# EasyEDA Pro project ProPrj_星闪核心板_2024-08-30.epro

# Schematic 星闪
Board Name: 星闪; Create Date: 2024-08-24; Page Name: Sheet_1; Project Name: 星闪核心板; Schematic Name: 星闪; Update Date: 2024-08-27; Company: Hny0305Lin & LiRong; Draw By: LiRong; REV: 1.0.1
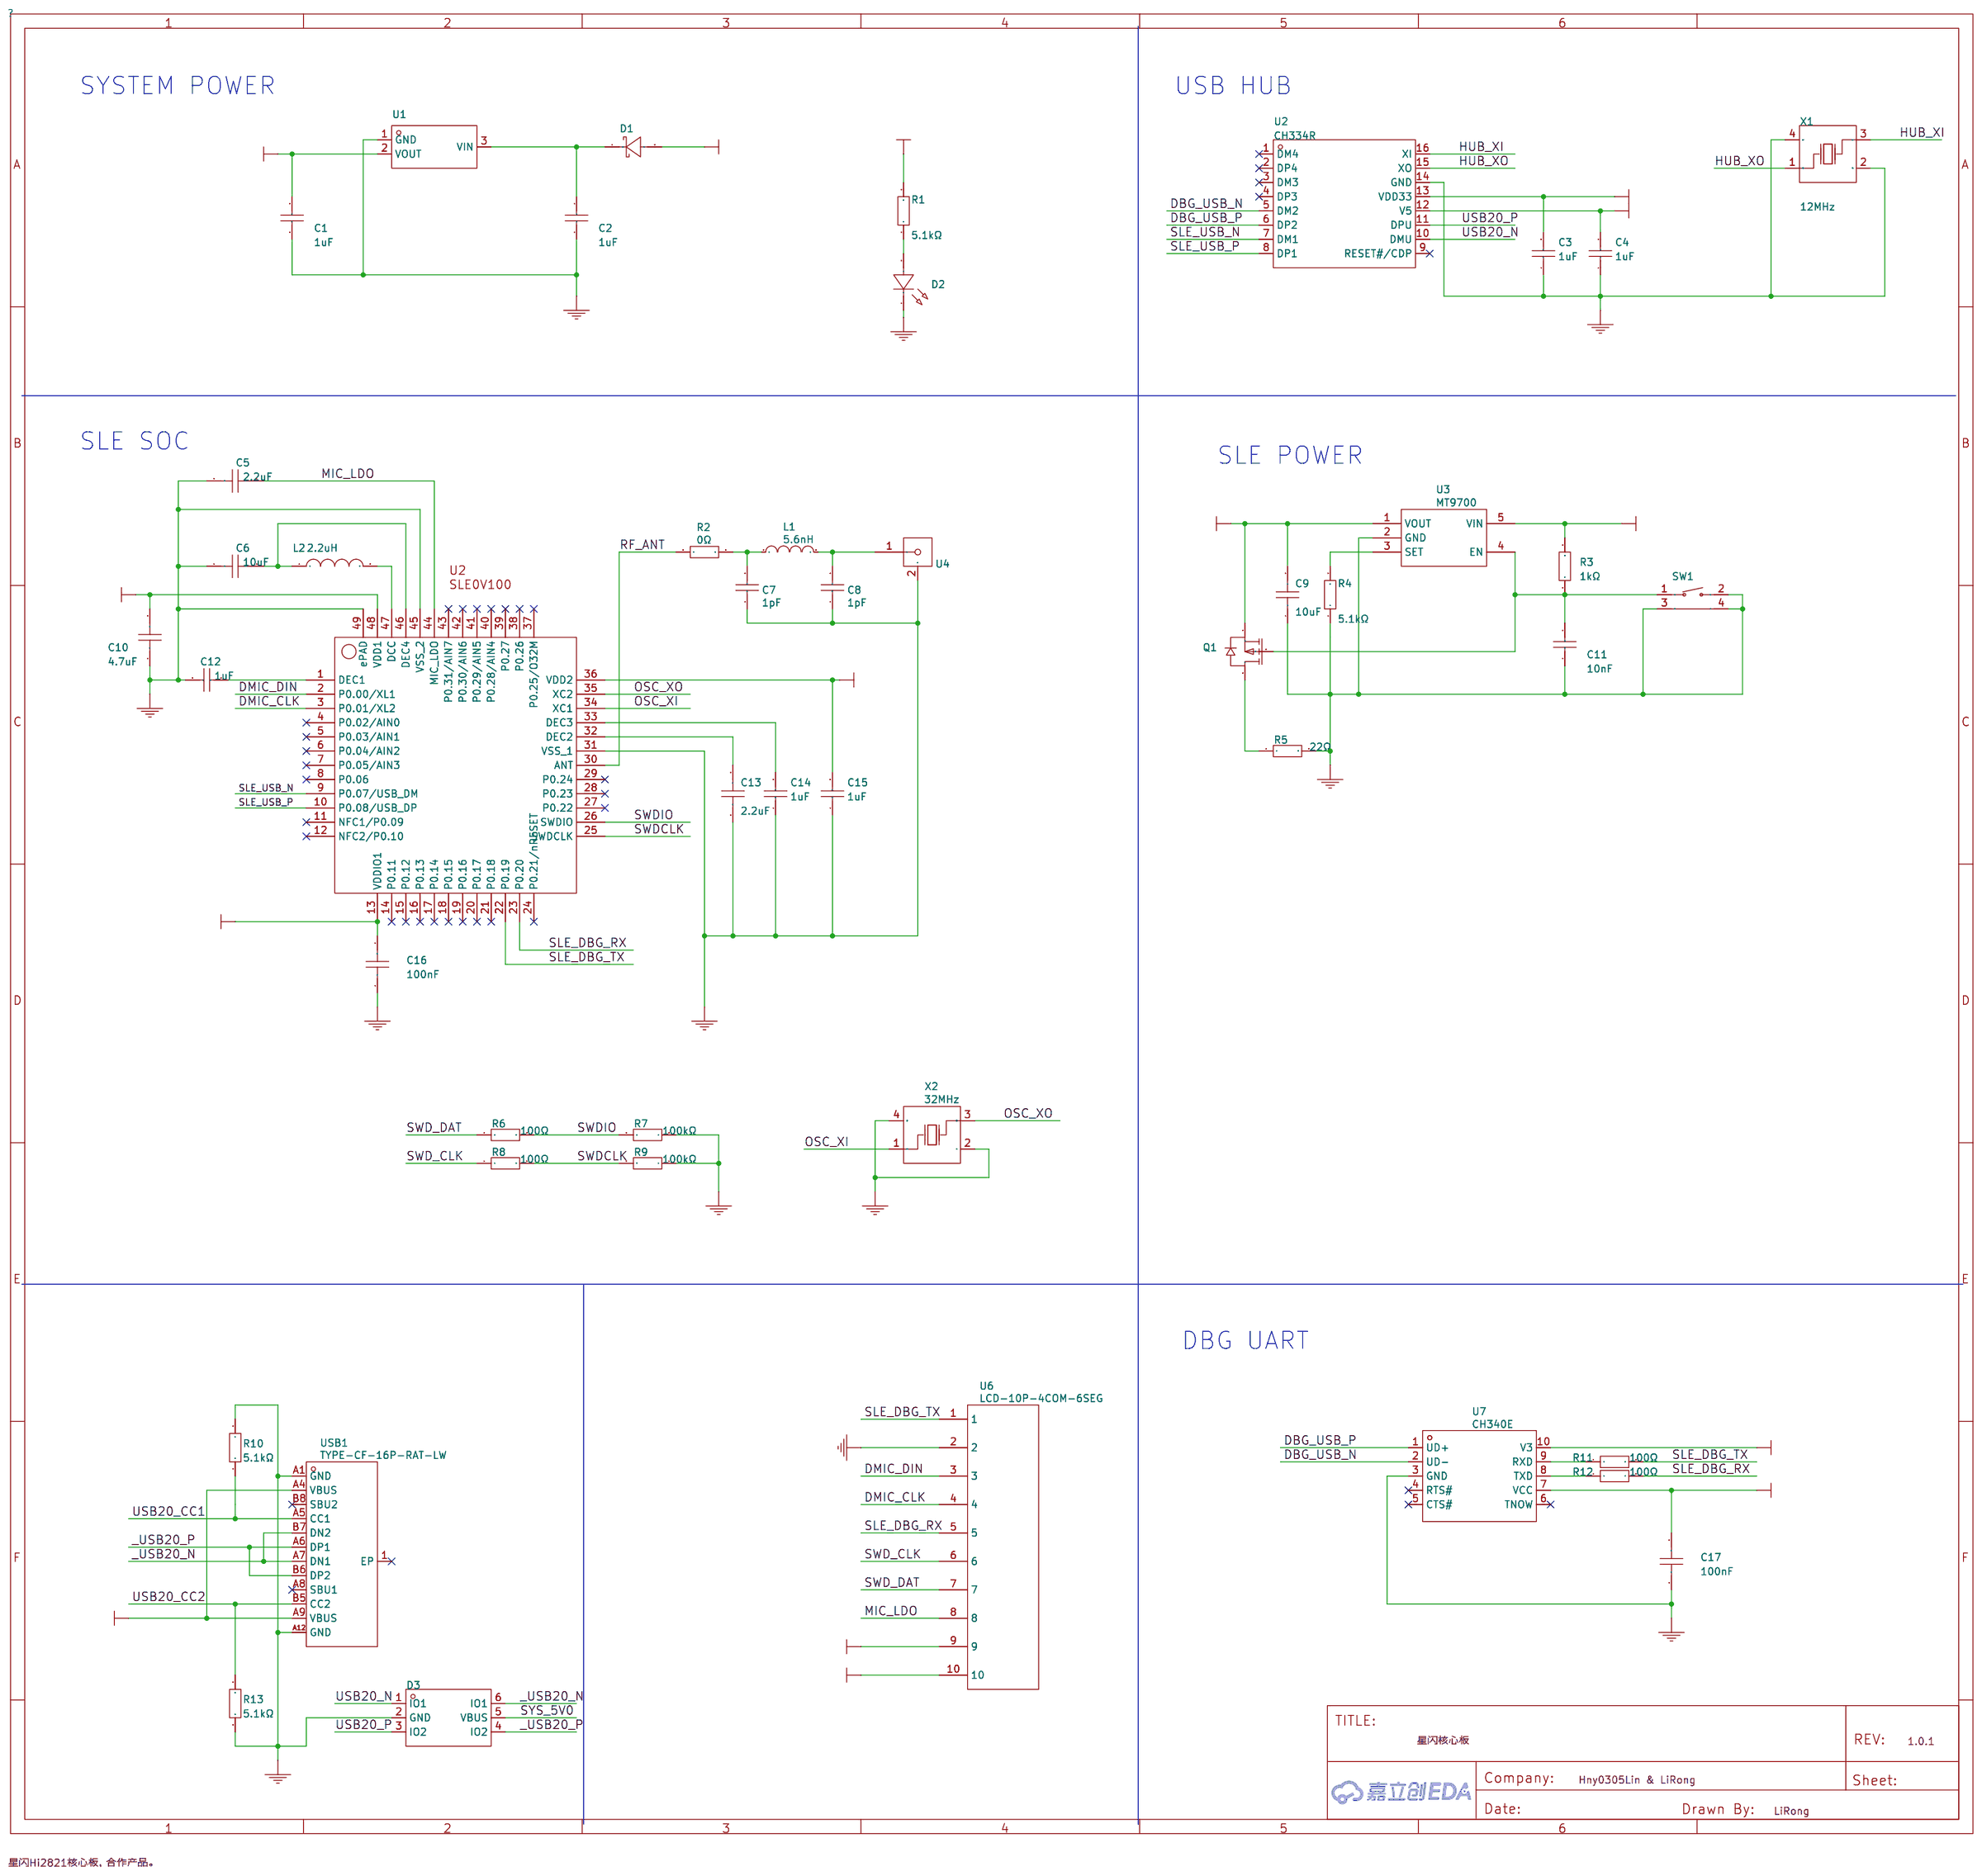
[diagram p0: schematic sheet]

## Parts
C1  1uF  [C0603]
C2  1uF  [C0603]
C3  1uF  [C0402]
C4  1uF  [C0402]
C5  2.2uF  [C0402]
C6  10uF  [C0603]
C7  1pF  [C0201]
C8  1pF  [C0201]
C9  10uF  [C0603]
C10  4.7uF  [C0402]
C11  10nF  [C0402]
C12  1uF  [C0402]
C13  2.2uF  [C0402]
C14  1uF  [C0402]
C15  1uF  [C0402]
C16  100nF  [C0402]
C17  100nF  [C0402]
D1  B5817WS  [SOD-323_L1.7-W1.3-LS2.5-RD]
D2  XL-1608SURC-06  [LED0603-RD_RED]
D3  USBLC6-2SC6  [SOT-23-6_L2.9-W1.6-P0.95-LS2.8-BL]
L1  5.6nH  [L0201]
L2  2.2uH  [0805]
Q1  RU20P7C-A  [SOT-23-3_L3.0-W1.6-P1.90-LS2.8-BR]
R1  5.1kΩ  [R0402]
R2  0Ω  [R0201]
R3  1kΩ  [R0402]
R4  5.1kΩ  [R0402]
R5  22Ω  [R0402]
R6  100Ω  [R0402]
R7  100kΩ  [R0402]
R8  100Ω  [R0402]
R9  100kΩ  [R0402]
R10  5.1kΩ  [R0402]
R11  100Ω  [R0402]
R12  100Ω  [R0402]
R13  5.1kΩ  [R0402]
SW1  TS-1135-C  [SW-SMD_YIYUAN_YTS-B017-2H]
U1  XC6206-3.3NR  [SOT-23-3_L2.9-W1.3-P0.95-LS2.4-BR]
U2  CH334R  [QSOP-16_L4.9-W3.9-P0.64-LS6.0-BL]
U3  MT9700  [SOT-23-5_L3.0-W1.7-P0.95-LS2.8-BR]
U4  U.FL-R-SMT-1(80)_C9900020048  [IPEX-SMD_4P-L2.6-W2.6-LS3.0-1]
U5  SLE0V100(1)  [QFN_48XINGSHAN]
U6  LCD-10P-4COM-6SEG  [DU10_3.5]
U7  CH340E  [MSOP-10_L3.0-W3.0-P0.50-LS5.0-BL]
USB1  TYPE-CF-16P-RAT-LW  [TYPE-C-SMD_TYPE-CF-16P-RAT-LW]
X1  12MHz  [OSC-SMD_4P-L3.2-W2.5-BL]
X2  32MHz  [CRYSTAL-SMD_4P-L3.2-W2.5-BL]

## Library data of the parts
C1 C2 = CL10A105KO8NNNC: 容值:1uF;精度:±10%;额定电压:16V;材质(温度系数):X5R;; LCSC Part Name: 1uF ±10% 16V; Supplier Part: C1592; Manufacturer: SAMSUNG(三星); Supplier Footprint: 0603; Datasheet: https://atta.szlcsc.com/upload/public/pdf/source/20220919/9FBE606BE0D9532D730F292EB26DC5BB.pdf; Supplier: LCSC; Tolerance: ±10%; Voltage Rated: 16V; Temperature Coefficient: X5R
C3 C4 C12 C14 C15 = CL05A105KP5NNNC: 容值:1uF;精度:±10%;额定电压:10V;材质(温度系数):X5R;; LCSC Part Name: 1uF ±10% 10V; Supplier Part: C14445; Manufacturer: SAMSUNG(三星); Supplier Footprint: 0402; JLCPCB Part Class: 扩展库; Datasheet: https://atta.szlcsc.com/upload/public/pdf/source/20160218/1457707763339.pdf; Supplier: LCSC; Tolerance: ±10%; Voltage Rated: 10V; Temperature Coefficient: X5R
C5 C13 = CL05A225KP5NSNC: 容值:2.2uF;精度:±10%;额定电压:10V;材质(温度系数):X5R;; LCSC Part Name: 2.2uF ±10% 10V; Supplier Part: C107369; Manufacturer: SAMSUNG(三星); Supplier Footprint: 0402; JLCPCB Part Class: 扩展库; Datasheet: https://atta.szlcsc.com/upload/public/pdf/source/20160218/1457707763339.pdf; Supplier: LCSC; Tolerance: ±10%; Voltage Rated: 10V; Temperature Coefficient: X5R
C6 C9 = CL10A106MP8NNNC: 容值:10uF;精度:±20%;额定电压:10V;材质(温度系数):X5R;; LCSC Part Name: 10uF ±20% 10V; Supplier Part: C85713; Manufacturer: SAMSUNG(三星); Supplier Footprint: 0603; JLCPCB Part Class: 扩展库; Datasheet: https://atta.szlcsc.com/upload/public/pdf/source/20160218/1457707763339.pdf; Supplier: LCSC; Tolerance: ±20%; Voltage Rated: 10V; Temperature Coefficient: X5R
C7 C8 = 1pF: Supplier: LCSC; Manufacturer: muRata(村田); Manufacturer Part: GRM0335C1E1R0BA01D; Supplier Part: C88903; JLCPCB Part Class: Extended Part
C10 = CL05A475MQ5NRNC: 容值:4.7uF;精度:±20%;额定电压:6.3V;材质(温度系数):X5R;; LCSC Part Name: 4.7uF ±20% 6.3V; Supplier Part: C307423; Manufacturer: SAMSUNG(三星); Supplier Footprint: 0402; JLCPCB Part Class: 扩展库; Datasheet: https://atta.szlcsc.com/upload/public/pdf/source/20181010/C307423_0E0C4E35F3A09F81C2E5C84E00499E42.pdf; Supplier: LCSC; Tolerance: ±20%; Voltage Rated: 6.3V; Temperature Coefficient: X5R
C11 = CC0402KRX7R9BB103: 容值:10nF;精度:±10%;额定电压:50V;材质(温度系数):X7R;; LCSC Part Name: 10nF ±10% 50V; Supplier Part: C60133; Manufacturer: YAGEO(国巨); Supplier Footprint: 0402; JLCPCB Part Class: 扩展库; Datasheet: https://atta.szlcsc.com/upload/public/pdf/source/20180224/C181747_15194369449651363981.pdf; Supplier: LCSC; Tolerance: ±10%; Voltage Rated: 50V; Temperature Coefficient: X7R
C16 C17 = CL05B104KO5NNNC: 容值:100nF;精度:±10%;额定电压:16V;材质(温度系数):X7R;; LCSC Part Name: 100nF ±10% 16V; Supplier Part: C1525; Manufacturer: SAMSUNG(三星); Supplier Footprint: 0402; JLCPCB Part Class: 基础库; Datasheet: https://atta.szlcsc.com/upload/public/pdf/source/20160218/1457707763339.pdf; Supplier: LCSC; Tolerance: ±10%; Voltage Rated: 16V; Temperature Coefficient: X7R
D1 = B5817WS_C5178966: 二极管配置:独立式;正向压降(Vf):450mV@1A;直流反向耐压(Vr):20V;平均整流电流(Io):1A;; Supplier Part: C5178966; Manufacturer: FUXINSEMI(富芯森美); Supplier Footprint: SOD-323; JLCPCB Part Class: 扩展库; Datasheet: https://atta.szlcsc.com/upload/public/pdf/source/20220920/7F1C3B1AD8E64D51E240979EF5B99150.pdf; Supplier: LCSC; Diode Configuration: 独立式; Forward Voltage (Vf@If): 450mV@1A; Reverse Voltage (Vr): 20V; Average Rectified Current (Io): 1A; Reverse Leakage Current (Ir): 1mA@20V; Peak forward surge current: 9A
D2 = XL-1608SURC-06: 发光颜色:红色;功率:55mW;正向电流:25mA;主波长:617nm~621nm;透镜颜色:无色透明透镜;色温:-;发光角度:120°;载带方式:正贴;工作温度:-30℃~+85℃;; Supplier Part: C965799; Manufacturer: XINGLIGHT(成兴光); Supplier Footprint: 0603; JLCPCB Part Class: Extended Part; Datasheet: https://atta.szlcsc.com/upload/public/pdf/source/20221102/D860AFDD1CDB02C5A8064103A32707E2.pdf; Supplier: LCSC; Emitted Color: 红色; Power Dissipation: 55mW; Forward Current: 25mA; Dominant Wavelength: 617nm~621nm; Peak Wavelength: 623nm; Lens Color: 无色透明透镜; Viewing Angle: 120°; Mounting Sytle: 正贴; Operating Temperature: -30℃~+85℃
D3 = USBLC6-2SC6_C2827654: 极性:-;反向截止电压(Vrwm):-;最大钳位电压:-;峰值脉冲电流(Ipp)@10/1000us:-;峰值脉冲功率(Ppp)@10/1000us:-;击穿电压:-;; LCSC Part Name: ESD，可防30kV静电; Supplier Part: C2827654; Manufacturer: TECH PUBLIC(台舟); Supplier Footprint: SOT-23-6; JLCPCB Part Class: 扩展库; Datasheet: https://atta.szlcsc.com/upload/public/pdf/source/20210810/FBD75DE717D6D97BAC6DD7F2B5C09DCD.pdf; Supplier: LCSC; Type: ESD
L1 = 5.6nH: Supplier: LCSC; Manufacturer: muRata(村田); Manufacturer Part: LQP03TN5N6H02D; Supplier Part: C86127; JLCPCB Part Class: Extended Part
L2 = MGFL2012F2R2MT-LF: 电感值:2.2uH;精度:±20%;额定电流:1.2A;饱和电流(Isat):-;直流电阻(DCR):200mΩ;; LCSC Part Name: 2.2uH ±20%; Supplier Part: C281115; Manufacturer: microgate(麦捷科技); JLCPCB Part Class: Extended Part; Datasheet: https://atta.szlcsc.com/upload/public/pdf/source/20181025/C281115_505B7E12862DFB0F0E16D6C8DCCBFFF1.pdf; Supplier: LCSC; Tolerance: ±20%; Rated Current: 1.2A; DC Resistance (DCR): 200mΩ
Q1 = RU20P7C-A: Supplier: LCSC; Supplier Part: C2977192; Manufacturer: Ruichips(锐骏半导体)
R1 R4 R10 R13 = 0402WGF5101TCE: 电阻类型:厚膜电阻;阻值:5.1kΩ;精度:±1%;功率:62.5mW;最大工作电压:50V;温度系数:±100ppm/℃;; LCSC Part Name: 5.1kΩ ±1% 62.5mW 厚膜电阻; Supplier Part: C25905; Manufacturer: UNI-ROYAL(厚声); Supplier Footprint: 0402; JLCPCB Part Class: 基础库; Datasheet: https://atta.szlcsc.com/upload/public/pdf/source/20200306/C422600_1E6D84923E4A46A82E41ADD87F860B5C.pdf; Supplier: LCSC; Type: 厚膜电阻; Tolerance: ±1%; Power(Watts): 62.5mW; Overload Voltage (Max): 50V; Temperature Coefficient: ±100ppm/℃; Operating Temperature Range: -55℃~+155℃
R2 = 0Ω: Supplier: LCSC; Supplier Part: C270337; Manufacturer: UNI-ROYAL(厚声); Manufacturer Part: 0201WMJ0000TEE; JLCPCB Part Class: Extended Part
R3 = 0402WGF1001TCE: 电阻类型:厚膜电阻;阻值:1kΩ;精度:±1%;功率:62.5mW;最大工作电压:50V;温度系数:±100ppm/℃;; LCSC Part Name: 1kΩ ±1% 62.5mW 厚膜电阻; Supplier Part: C11702; Manufacturer: UNI-ROYAL(厚声); Supplier Footprint: 0402; JLCPCB Part Class: 基础库; Datasheet: https://atta.szlcsc.com/upload/public/pdf/source/20200306/C422600_1E6D84923E4A46A82E41ADD87F860B5C.pdf; Supplier: LCSC; Type: 厚膜电阻; Tolerance: ±1%; Power(Watts): 62.5mW; Overload Voltage (Max): 50V; Temperature Coefficient: ±100ppm/℃; Operating Temperature Range: -55℃~+155℃
R5 = 0402WGF220JTCE: 电阻类型:厚膜电阻;阻值:22Ω;精度:±1%;功率:62.5mW;最大工作电压:50V;温度系数:±100ppm/℃;; LCSC Part Name: 22Ω ±1% 62.5mW 厚膜电阻; Supplier Part: C25092; Manufacturer: UNI-ROYAL(厚声); Supplier Footprint: 0402; JLCPCB Part Class: 基础库; Datasheet: https://atta.szlcsc.com/upload/public/pdf/source/20200306/C422600_1E6D84923E4A46A82E41ADD87F860B5C.pdf; Supplier: LCSC; Type: 厚膜电阻; Tolerance: ±1%; Power(Watts): 62.5mW; Overload Voltage (Max): 50V; Temperature Coefficient: ±100ppm/℃; Operating Temperature Range: -55℃~+155℃
R6 R8 R11 R12 = 0402WGF1000TCE: 电阻类型:厚膜电阻;阻值:100Ω;精度:±1%;功率:62.5mW;最大工作电压:50V;温度系数:±200ppm/℃;; LCSC Part Name: 100Ω ±1% 62.5mW 厚膜电阻; Supplier Part: C25076; Manufacturer: UNI-ROYAL(厚声); Supplier Footprint: 0402; JLCPCB Part Class: 基础库; Datasheet: https://atta.szlcsc.com/upload/public/pdf/source/20200306/C422600_1E6D84923E4A46A82E41ADD87F860B5C.pdf; Supplier: LCSC; Type: 厚膜电阻; Tolerance: ±1%; Power(Watts): 62.5mW; Overload Voltage (Max): 50V; Temperature Coefficient: ±200ppm/℃; Operating Temperature Range: -55℃~+155℃
R7 R9 = RC0402FR-07100KL: 电阻类型:厚膜电阻;阻值:100kΩ;精度:±1%;功率:62.5mW;最大工作电压:50V;温度系数:±100ppm/℃;; LCSC Part Name: 厚膜电阻 100kΩ ±1% 62.5mW; Supplier Part: C60491; Manufacturer: YAGEO(国巨); Supplier Footprint: 0402; JLCPCB Part Class: 扩展库; Datasheet: https://atta.szlcsc.com/upload/public/pdf/source/20180927/C295883_E8D83085EA81BD7DE0B2B681138C15EE.pdf; Supplier: LCSC; Type: 厚膜电阻; Tolerance: ±1%; Power(Watts): 62.5mW; Overload Voltage (Max): 50V; Temperature Coefficient: ±100ppm/℃; Operating Temperature Range: -55℃~+155℃
SW1 = TS-1135-C: 电路结构:单刀单掷;按钮形状:矩形按钮;作用力:260gf;安装方式:-;开关长度:6.15mm;开关宽度:3.55mm;开关高度:2.45mm;带支架:不带;触点电流:50mA;额定电压(AC):-;额定电压(DC):12V;额定功率:-;绝缘电阻:-;带灯:无;机械寿命:10万次;; LCSC Part Name: 3*6包盖 沉板式侧按键开关TS-1135-C; Supplier Part: C519275; Manufacturer: XKB Connectivity(中国星坤); Supplier Footprint: SMD; Datasheet: https://atta.szlcsc.com/upload/public/pdf/source/20200423/C519275_2FF3ECA9711A0F372711CEA0AA6AFE29.pdf; Supplier: LCSC; Circuit: 单刀单掷; Actuator Style: 矩形按钮; Operating Force: 260gf; Switch Length: 6.15mm; Switch Width: 3.55mm; Switch Height: 2.45mm; Strike Gundam: 不带; Contact Current: 50mA; Voltage Rating (DC): 12V; Actuator/Cap Color: 白色; With Lamp: 无; Mechanical Life: 10万次; Operating Temperature: -40℃~+90℃
U1 = XC6206-3.3NR: LCSC Part Name: XC6206-3.3NR小体积; Supplier Part: C2984874; Manufacturer: HX(恒佳兴); Supplier Footprint: SOT-23; JLCPCB Part Class: 扩展库; Datasheet: https://atta.szlcsc.com/upload/public/pdf/source/20220328/86A37D0E6EE2F6DF94D50B2B86284E3B.pdf; Supplier: LCSC
U2 = CH334R: Supplier: LCSC; Supplier Part: C4154405; Manufacturer: WCH(南京沁恒); JLCPCB Part Class: Extended Part
U3 = MT9700: Supplier: LCSC; Manufacturer: 西安航天民芯; Supplier Part: C89855; JLCPCB Part Class: Extended Part
U4 = U.FL-R-SMT-1(80)_C9900020048: Supplier: LCSC; Supplier Part: C9900020048; Manufacturer: null; Manufacturer Part: U.FL-R-SMT-1(80); JLCPCB Part Class: Extended Part; Check: false
U5 = SLE0V100(1): Check: false
U6 = LCD-10P-4COM-6SEG: Supplier Part: 10p; Check: false
U7 = CH340E: Supplier: LCSC; Manufacturer: WCH(南京沁恒); Supplier Part: C99652; JLCPCB Part Class: Extended Part
USB1 = TYPE-CF-16P-RAT-LW: Supplier: LCSC; Supplier Part: C9900026770; Manufacturer: null; JLCPCB Part Class: Extended Part; Check: false
X1 = X322512MSB4SI: 晶振类型:贴片晶振;频率:12MHz;常温频差:±10ppm;外接负载电容:20pF;频率稳定度(全温):±20ppm;; LCSC Part Name: 12MHz ±10ppm 20pF; Supplier Part: C9002; Manufacturer: YXC(扬兴晶振); Supplier Footprint: SMD3225-4P; JLCPCB Part Class: 基础库; Datasheet: https://atta.szlcsc.com/upload/public/pdf/source/20240329/19D5F850207469550BEB00D7DFEDBC7A.pdf; Supplier: LCSC; Crystal Type: 贴片晶振; Normal temperature Frequency Tolerance: ±10ppm; External load capacitor: 20pF; Frequency Stability(Full temperature range): ±20ppm; Operating Temperature: -40℃~+85℃
X2 = S3232000081040: 晶振类型:贴片晶振;频率:32MHz;常温频差:±10ppm;外接负载电容:8pF;; LCSC Part Name: 32MHz ±10ppm 8pF; Supplier Part: C426985; Manufacturer: JGHC(晶光华); Supplier Footprint: SMD3225-4P; JLCPCB Part Class: Extended Part; Datasheet: https://atta.szlcsc.com/upload/public/pdf/source/20191012/C431172_99BCDFC5E39E114929AE7F9C9DED2B9F.pdf; Supplier: LCSC; Crystal Type: 贴片晶振; Normal temperature Frequency Tolerance: ±10ppm; External load capacitor: 8pF; Equivalent Series Resistance (ESR): 40Ω; Operating Temperature: -40℃~+85℃

## Nets
GND: C1.1 C2.1 C3.1 C4.1 C5.2 C6.1 C7.1 C8.1 C9.1 C10.1 C11.1 C12.1 C13.1 C14.1 C15.1 C16.1 C17.1 D2.1(K) D3.2(GND) R4.1 R5.2 R7.1 R9.1 R10.2 R13.1 SW1.2 SW1.3 SW1.4 U1.1(GND) U2.14(GND) U3.2(GND) U4.2 U5.31(VSS_1) U5.45(VSS_2) U5.49(ePAD) U6.2 U7.3(GND) USB1.A1(GND) USB1.A12(GND) X1.2(GND) X1.4(GND) X2.2(GND) X2.4(GND)
_USB20_N: D3.6(IO1) USB1.A7(DN1) USB1.B7(DN2)
_USB20_P: D3.4(IO2) USB1.A6(DP1) USB1.B6(DP2)
DBG_3V3: C3.2 C17.2 U2.13(VDD33) U7.7(VCC) U7.10(V3)
DBG_USB_N: U2.5(DM2) U7.2(UD-)
DBG_USB_P: U2.6(DP2) U7.1(UD+)
DMIC_CLK: U5.3(P0.01/XL2) U6.4
DMIC_DIN: U5.2(P0.00/XL1) U6.3
HUB_XI: U2.16(XI) X1.3(OSC2)
HUB_XO: U2.15(XO) X1.1(OSC1)
MIC_LDO: C5.1 U5.44(MIC_LDO) U6.8
OSC_XI: U5.34(XC1) X2.1(OSC1)
OSC_XO: U5.35(XC2) X2.3(OSC2)
RF_ANT: R2.1 U5.30(ANT)
SLE_3V3: C9.2 C10.2 C15.2 C16.2 Q1.2(S) U3.1(VOUT) U5.13(VDDIO1) U5.36(VDD2) U5.48(VDD1)
SLE_DBG_RX: R12.2 U5.23(P0.20) U6.5
SLE_DBG_TX: R11.2 U5.22(P0.19) U6.1
SLE_USB_N: U2.7(DM1) U5.9(P0.07/USB_DM)
SLE_USB_P: U2.8(DP1) U5.10(P0.08/USB_DP)
SWD_CLK: R8.1 U6.6
SWD_DAT: R6.1 U6.7
SWDCLK: R8.2 R9.2 U5.25(SWDCLK)
SWDIO: R6.2 R7.2 U5.26(SWDIO)
SYS_3V3: C1.2 R1.2 R3.2 U1.2(VOUT) U3.5(VIN) U6.9
SYS_5V0: C4.2 D1.2(A) D3.5(VBUS) U2.12(V5) U6.10 USB1.A4(VBUS) USB1.A9(VBUS)
USB20_CC1: R10.1 USB1.A5(CC1)
USB20_CC2: R13.2 USB1.B5(CC2)
USB20_N: D3.1(IO1) U2.10(DMU)
USB20_P: D3.3(IO2) U2.11(DPU)
$1N5: C8.2 L1.2 U4.1
$1N6: C7.2 L1.1 R2.2
$1N16: Q1.3(D) R5.1
$1N45: C2.2 D1.1(C) U1.3(VIN)
$1N49: L2.2 U5.47(DCC)
$1N98: D2.2(A) R1.1
$1N2110: C12.2 U5.1(DEC1)
$1N2624: C14.2 U5.33(DEC3)
$1N2741: C13.2 U5.32(DEC2)
$1N3792: C6.2 L2.1 U5.46(DEC4)
$1N4086: R11.1 U7.9(RXD)
$1N4091: R12.1 U7.8(TXD)
$1N5044: R4.2 U3.3(SET)
$1N8181: C11.2 Q1.1(G) R3.1 SW1.1 U3.4(EN)

Not connected (* = marked no-connect by the designer): U2 1(DM4)* 2(DP4)* 3(DM3)* 4(DP3)* 9(RESET#/CDP)*; U5 4(P0.02/AIN0)* 5(P0.03/AIN1)* 6(P0.04/AIN2)* 7(P0.05/AIN3)* 8(P0.06)* 11(NFC1/P0.09)* 12(NFC2/P0.10)* 14(P0.11)* 15(P0.12)* 16(P0.13)* 17(P0.14)* 18(P0.15)* 19(P0.16)* 20(P0.17)* 21(P0.18)* 24(P0.21/nRESET)* 27(P0.22)* 28(P0.23)* 29(P0.24)* 37(P0.25/O32M)* 38(P0.26)* 39(P0.27)* 40(P0.28/AIN4)* 41(P0.29/AIN5)* 42(P0.30/AIN6)* 43(P0.31/AIN7)*; U7 4(RTS#)* 5(CTS#)* 6(TNOW)*; USB1 1(EP)* A8(SBU1)* B8(SBU2)*

## Notes on the sheet
- SYSTEM POWER
- USB HUB
- SLE SOC
- SLE POWER
- DBG UART

# Board PCB_星闪
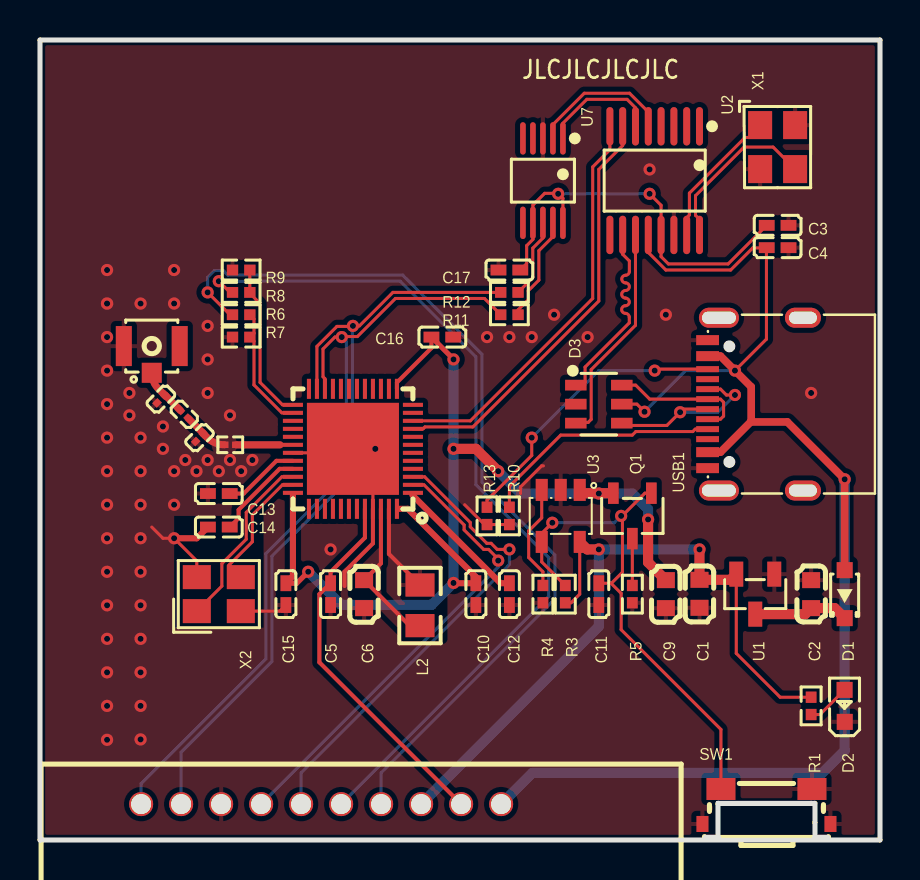
[diagram p1: board, top side]
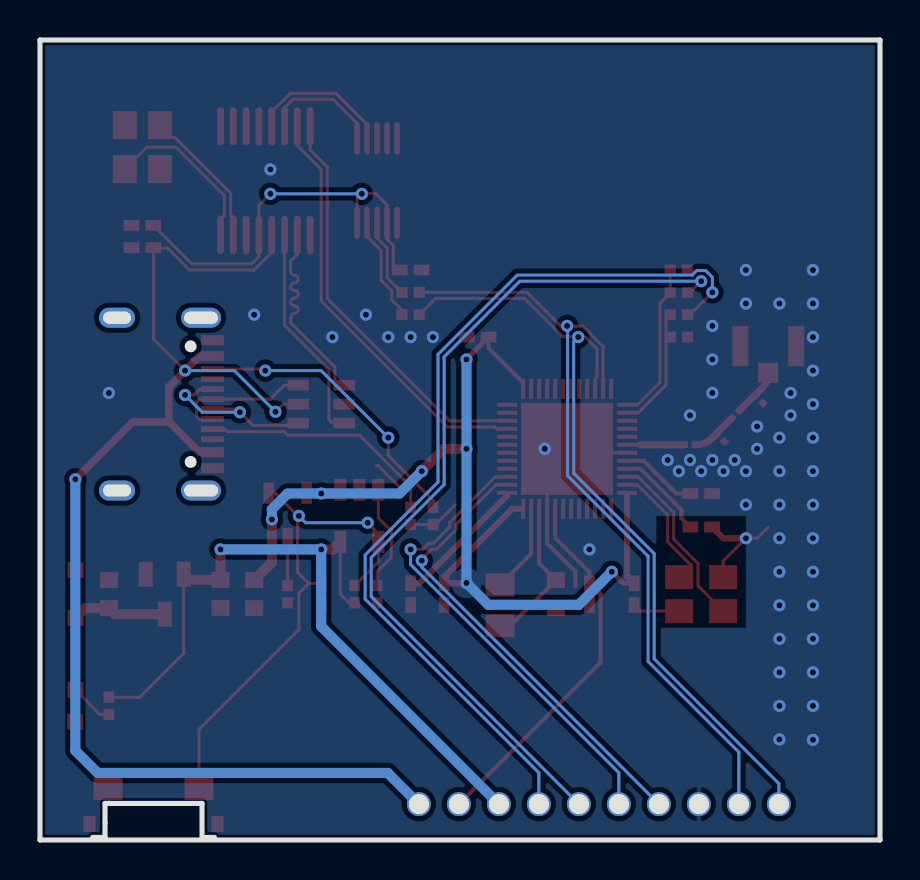
[diagram p2: board, bottom side, seen from below]

Outline 42 x 40 mm; copper layers: Top Layer, Bottom Layer. Coordinates in mm from the lower left corner of the outline.
Outline path: 0,40 42,40 42,0 0,0 0,40
Stack: Top Layer 0.035mm / Dielectric1 1.51mm FR4 er 4.5 / Bottom Layer 0.035mm

## Design rules (mm)
template: 用户自定义配置
spacing Default (default): track to track 0.152, other pairs 0 to 0.152
track width Default (default): min 0.152, default 0.152, max 25.4
differential pair differentialPair (default): width min 0.127, default 0.254, max 2.54; gap min 0.152, default 0.152
via Default (default): diameter min 0.61, default 0.61, max 100.025; hole min 0.305, default 0.305, max 59.995
net GND uses gge6592(1)
pour e1 uses gge6592
pour e653 uses gge6592(1)

## Placement (name value [footprint] x y rotation side)
C1  1uF  [C0603]  32.97 12.31 90 top
C2  1uF  [C0603]  38.56 12.29 270 top
C3  1uF  [C0402]  36.88 30.73 180 top
C4  1uF  [C0402]  36.88 29.62 180 top
C5  2.2uF  [C0402]  14.53 12.29 270 top
C6  10uF  [C0603]  16.21 12.29 90 top
C7  1pF  [C0201]  7.98 20.12 45 top
C8  1pF  [C0201]  6.04 22.05 45 top
C9  10uF  [C0603]  31.29 12.29 90 top
C10  4.7uF  [C0402]  21.79 12.29 90 top
C11  10nF  [C0402]  27.94 12.29 90 top
C12  1uF  [C0402]  23.47 12.29 90 top
C13  2.2uF  [C0402]  8.94 17.32 0 top
C14  1uF  [C0402]  8.94 15.65 0 top
C15  1uF  [C0402]  12.29 12.29 90 top
C16  100nF  [C0402]  20.12 25.15 180 top
C17  100nF  [C0402]  23.47 28.5 0 top
D1  B5817WS  [SOD-323_L1.7-W1.3-LS2.5-RD]  40.23 12.29 90 top
D2  XL-1608SURC-06  [LED0603-RD_RED]  40.23 6.71 90 top
D3  USBLC6-2SC6  [SOT-23-6_L2.9-W1.6-P0.95-LS2.8-BL]  27.94 21.79 270 top
L1  5.6nH  [L0201]  7.21 21.28 135 top
L2  2.2uH  [0805]  19 11.73 90 top
Q1  RU20P7C-A  [SOT-23-3_L3.0-W1.6-P1.90-LS2.8-BR]  29.62 16.2 90 top
R1  5.1kΩ  [R0402]  38.56 6.71 90 top
R2  0Ω  [R0201]  9.51 19.76 180 top
R3  1kΩ  [R0402]  26.26 12.29 270 top
R4  5.1kΩ  [R0402]  25.15 12.29 90 top
R5  22Ω  [R0402]  29.62 12.29 270 top
R6  100Ω  [R0402]  10.06 26.26 0 top
R7  100kΩ  [R0402]  10.06 25.15 0 top
R8  100Ω  [R0402]  10.06 27.38 0 top
R9  100kΩ  [R0402]  10.06 28.5 0 top
R10  5.1kΩ  [R0402]  23.47 16.2 270 top
R11  100Ω  [R0402]  23.47 26.26 180 top
R12  100Ω  [R0402]  23.47 27.38 180 top
R13  5.1kΩ  [R0402]  22.35 16.2 90 top
SW1  TS-1135-C  [SW-SMD_YIYUAN_YTS-B017-2H]  36.32 1.68 0 top
U1  XC6206-3.3NR  [SOT-23-3_L2.9-W1.3-P0.95-LS2.4-BR]  35.76 12.29 90 top
U2  CH334R  [QSOP-16_L4.9-W3.9-P0.64-LS6.0-BL]  30.73 32.97 180 top
U3  MT9700  [SOT-23-5_L3.0-W1.7-P0.95-LS2.8-BR]  26.04 16.2 90 top
U4  U.FL-R-SMT-1(80)_C9900020048  [IPEX-SMD_4P-L2.6-W2.6-LS3.0-1]  5.59 24.03 0 top
U5  SLE0V100(1)  [QFN_48XINGSHAN]  15.65 19.56 180 top
U6  LCD-10P-4COM-6SEG  [DU10_3.5]  29.06 -6.71 180 top
U7  CH340E  [MSOP-10_L3.0-W3.0-P0.50-LS5.0-BL]  25.15 32.97 180 top
USB1  TYPE-CF-16P-RAT-LW  [TYPE-C-SMD_TYPE-CF-16P-RAT-LW]  35.76 21.79 90 top
X1  12MHz  [OSC-SMD_4P-L3.2-W2.5-BL]  36.88 34.65 270 top
X2  32MHz  [CRYSTAL-SMD_4P-L3.2-W2.5-BL]  8.94 12.29 0 top

## Footprints (pads in the part's own frame, mm; a bottom-side part is the same pattern mirrored in y, then rotated)
0805
  rect 1.16x1.45 smd: 1(-1.016,0) 2(1.016,0)
C0201
  rect 0.368x0.324 smd: 1(-0.275,0) 2(0.275,0)
C0402
  rect 0.79x0.54 smd: 1(-0.545,0) 2(0.545,0)
C0603
  rect 0.8x0.9 smd: 1(-0.7,0) 2(0.7,0)
CRYSTAL-SMD_4P-L3.2-W2.5-BL
  rect 1.4x1.2 smd: 1(-1.1,-0.85) 2(1.1,-0.85) 3(1.1,0.85) 4(-1.1,0.85)
DU10_3.5
  round 1.2 hole 0.75x1: 1(24,-8.5) 2(20,-8.5) 3(18,-8.5) 4(16,-8.5) 5(22,-8.5) 6(14,-8.5) 7(12,-8.5) 8(8,-8.5) 9(10,-8.5) 10(6,-8.5)
IPEX-SMD_4P-L2.6-W2.6-LS3.0-1
  rect 1x1 smd: 1(0,-0.667)
  rect 0.8x2 smd: 2(-1.397,0.667) 3(1.397,0.667)
L0201
  rect 0.368x0.324 smd: 1(-0.275,0) 2(0.275,0)
LED0603-RD_RED
  rect 0.8x0.8 smd: 1(-0.799,-0.004) 2(0.799,0.004)
MSOP-10_L3.0-W3.0-P0.50-LS5.0-BL
  oval 0.28x1.62 smd: 1(-1,-2.11) 2(-0.5,-2.11) 3(0,-2.11) 4(0.5,-2.11) 5(1,-2.11) 6(1,2.11) 7(0.5,2.11) 8(0,2.11) 9(-0.5,2.11) 10(-1,2.11)
OSC-SMD_4P-L3.2-W2.5-BL
  rect 1.4x1.2 smd: 1(-1.1,-0.875) 2(1.1,-0.875) 3(1.1,0.875) 4(-1.1,0.875)
QFN_48XINGSHAN
  rect 1x0.2 smd: 1(-3,2.2) 2(-3,1.8) 3(-3,1.4) 4(-3,1) 5(-3,0.6) 6(-3,0.2) 7(-3,-0.2) 8(-3,-0.6) 9(-3,-1) 10(-3,-1.4) 11(-3,-1.8) 12(-3,-2.2) 25(3,-2.2) 26(3,-1.8) 27(3,-1.4) 28(3,-1) 29(3,-0.6) 30(3,-0.2) 31(3,0.2) 32(3,0.6) 33(3,1) 34(3,1.4) 35(3,1.8) 36(3,2.2)
  rect 0.2x1 smd: 13(-2.2,-3) 14(-1.8,-3) 15(-1.4,-3) 16(-1,-3) 17(-0.6,-3) 18(-0.2,-3) 19(0.2,-3) 20(0.6,-3) 21(1,-3) 22(1.4,-3) 23(1.8,-3) 24(2.2,-3) 37(2.2,3) 38(1.8,3) 39(1.4,3) 40(1,3) 41(0.6,3) 42(0.2,3) 43(-0.2,3) 44(-0.6,3) 45(-1,3) 46(-1.4,3) 47(-1.8,3) 48(-2.2,3)
  rect 4.6x4.6 smd: 49(0,0)
QSOP-16_L4.9-W3.9-P0.64-LS6.0-BL
  oval 0.35x1.921 smd: 1(-2.24,-2.716) 2(-1.6,-2.716) 3(-0.96,-2.716) 4(-0.32,-2.716) 5(0.32,-2.716) 6(0.96,-2.716) 7(1.6,-2.716) 8(2.24,-2.716) 9(2.24,2.716) 10(1.6,2.716) 11(0.96,2.716) 12(0.32,2.716) 13(-0.32,2.716) 14(-0.96,2.716) 15(-1.6,2.716) 16(-2.24,2.716)
R0201
  rect 0.303x0.324 smd: 1(-0.241,0) 2(0.241,0)
R0402
  rect 0.566x0.54 smd: 1(-0.433,0) 2(0.433,0)
SOD-323_L1.7-W1.3-LS2.5-RD
  rect 0.8x0.8 smd: 1(-1.2,0) 2(1.2,0)
SOT-23-3_L2.9-W1.3-P0.95-LS2.4-BR
  rect 1.25x0.7 smd: 1(1,-0.95) 2(1,0.95) 3(-1,0)
SOT-23-3_L3.0-W1.6-P1.90-LS2.8-BR
  rect 1.07x0.532 smd: 1(1.135,-0.95) 2(1.135,0.95) 3(-1.135,0)
SOT-23-5_L3.0-W1.7-P0.95-LS2.8-BR
  rect 1.1x0.6 smd: 1(1.3,-0.95) 2(1.3,0) 3(1.3,0.95) 4(-1.3,0.95) 5(-1.3,-0.95)
SOT-23-6_L2.9-W1.6-P0.95-LS2.8-BL
  rect 0.532x1.072 smd: 1(-0.95,-1.149) 2(0,-1.149) 3(0.95,-1.149) 4(0.95,1.149) 5(0,1.149) 6(-0.95,1.149)
SW-SMD_YIYUAN_YTS-B017-2H
  rect 1.45x1.1 smd: 1(-2.275,0.875) 2(2.275,0.875)
  rect 0.6x0.8 smd: 3(-3.2,-0.875) 4(3.2,-0.875)
TYPE-C-SMD_TYPE-CF-16P-RAT-LW
  oval 1x1.8 hole 0.6x1.4: 1(-4.32,-2.384) 2(4.32,-2.384)
  oval 1x2 hole 0.6x1.7: 3(4.32,1.816) 4(-4.32,1.816)
  rect 0.5x1.14 smd: A1(-3.2,2.384) A4(-2.4,2.384) A9(2.4,2.384) A12(3.2,2.384)
  rect 0.3x1.14 smd: A5(-1.25,2.384) A6(-0.25,2.384) A7(0.25,2.384) A8(1.25,2.384) B5(1.75,2.384) B6(0.75,2.384) B7(-0.75,2.384) B8(-1.75,2.384)

## Nets
As in the schematic.

Pads without a net: U2 1 2 3 4 9; U4 3; U5 4 5 6 7 8 11 12 14 15 16 17 18 19 20 21 24 27 28 29 37 38 39 40 41 42 43; U7 4 5 6; USB1 1 2 3 4 A8 B8

## Via types
v1: diameter 0.61, hole 0.305, Top Layer to Bottom Layer, 80 vias
v2: diameter 0.62, hole 0.31, Top Layer to Bottom Layer, 2 vias

## Routing (per net, layer and track width the routed paths; a pad name or vN(x,y) marks a point on that pad's centre or on a via; arc(x,y) is an arc through that point)
GND: length 24.1
  Top Layer w0.152: v2(16.76,19.56) 16.65,19.44 ; 16.65,19.44 16.56,19.36 U5.31 ; 16.65,19.44 U5.45 ; 21.23,16.76 22.23,15.77 R13.1 R10.2 ; 25.17,18.71 25.08,18.71 24.03,17.65 24.03,17.32 ; 5.59,15.65 6.15,15.09 v1(6.71,15.09) 7.84,13.95 X2.4 ; X2.2 11.99,11.44 C15.1
  Top Layer w0.203: 15.23,12.7 15.23,13.41 16.65,14.83 U5.45
  Top Layer w0.305: C14.1 7.84,15.09 v1(6.71,15.09)
  vias: v1(3.35,28.5) v1(3.35,25.15) v1(3.35,23.47) v1(3.35,21.79) v1(3.35,20.12) v1(3.35,18.44) v1(3.35,16.76) v1(3.35,15.09) v1(3.35,13.41) v1(3.35,11.73) v1(3.35,10.06) v1(3.35,8.38) v1(3.35,6.71) v1(3.35,5.01) v1(4.47,22.35) v1(4.47,21.23) v1(5.03,26.82) v1(5.03,20.12) v1(5.03,18.44) v1(5.03,16.76) v1(5.03,15.09) v1(5.03,13.41) v1(5.03,11.73) v1(5.03,10.06) v1(5.03,8.38) v1(5.03,6.71) v1(5.03,5.03) v1(6.15,20.68) v1(6.15,19.56) v1(6.71,28.5) v1(6.71,26.82) v1(6.71,18.44) v1(6.71,16.76) v1(7.26,19) v1(7.82,18.44) v1(8.38,25.7) v1(8.38,24.03) v1(8.38,22.35) v1(8.38,19) v1(8.94,18.44) v1(9.5,21.23) v1(9.5,19) v1(10.06,18.44) v1(10.62,19) v1(14.53,14.53) v1(22.35,25.15) v1(23.47,25.15) v1(24.59,25.15) v1(25.71,26.26) v1(27.38,25.15) v1(30.48,33.53) v1(31.29,26.26) v1(38.56,22.35) v2(3.35,26.82)
_USB20_N: length 7
  Top Layer w0.152: USB1.B7 34.03,21.04 34.18,21.2 34.18,21.89 34.03,22.04 USB1.A7 30.48,22.04 29.78,22.74 D3.6
_USB20_P: length 9.3
  Top Layer w0.152: D3.4 29.21,20.73 31.34,20.73 32.16,21.54 USB1.A6 ; USB1.B6 34.03,22.54 34.32,22.25 v1(34.75,22.25)
  Bottom Layer w0.152: v1(34.75,22.25) 33.88,21.39 v1(32.01,21.39)
DBG_3V3: length 20.8
  Top Layer w0.152: C3.2 34.41,28.8 31.42,28.8 31.05,29.17 31.05,31.73 v1(30.48,32.31) ; C17.2 24.33,28.82 24.33,29.72 24.65,30.03 U7.7 24.65,31.75 25.23,32.33 25.9,32.33 26.15,32.09 U7.10
  Bottom Layer w0.152: v1(30.48,32.31) v1(25.91,32.31)
DBG_USB_N: length 7.2
  Top Layer w0.152: U2.5 30.41,36.4 29.48,37.34 27.21,37.34 25.65,35.77 U7.2
DBG_USB_P: length 6
  Top Layer w0.152: U2.6 29.77,36.61 29.35,37.03 27.34,37.03 26.15,35.84 U7.1
DMIC_CLK: length 23.5
  Top Layer w0.152: v1(23.47,14.53) 22.86,14.53 22.56,14.83 22.34,14.83 21.51,15.66 21.51,15.88 19.23,18.16 U5.3
  Bottom Layer w0.152: U6.4 13.06,3.36 23.47,13.77 v1(23.47,14.53)
DMIC_DIN: length 23.1
  Top Layer w0.152: U5.2 19.2,17.76 21.21,15.75 21.21,15.51 22.18,14.53 22.43,14.53 22.91,14.05 v1(22.91,13.97)
  Bottom Layer w0.152: v1(22.91,13.97) 22.91,13.65 U6.3
HUB_XI: length 8.5
  Top Layer w0.152: X1.3 36.66,34.65 35.2,34.65 32.78,32.22 32.78,31.23 32.97,31.03 32.97,30.25
HUB_XO: length 7.4
  Top Layer w0.152: X1.1 36.01,35.28 35.85,35.13 35.26,35.13 32.47,32.34 32.47,31.25 32.33,31.11 32.33,30.25
MIC_LDO: length 18.7
  Top Layer w0.203: U6.8 13.97,8.88 13.97,12.29 14.53,12.85 ; U5.44 16.25,15.12 14.53,13.4 C5.1
OSC_XI: length 9
  Top Layer w0.152: U5.34 12.09,18.16 10.31,16.38 10.31,15.04 9.09,13.82 9.09,12.7 X2.1
OSC_XO: length 6.5
  Top Layer w0.152: X2.3 9.45,13.74 9.45,13.74 10.62,14.91 10.62,16.25 12.12,17.76 12.65,17.76
RF_ANT: length 2.2
  Top Layer w0.355: 12,19.76 9.8,19.76
SLE_3V3: length 53.7
  Top Layer w0.203: C16.2 19.57,24.6 17.85,22.88 U5.13
  Top Layer w0.254: v1(20.68,24.03) 20.68,24.04 C16.2 ; v1(13.41,13.41) 12.84,12.84 C15.2
  Top Layer w0.305: 17.96,16.56 18.39,16.56 21.79,13.15 C10.2 20.69,12.84 v1(20.68,12.85) ; 12.65,17.25 12.65,13.19 C15.2
  Top Layer w0.508: v1(30.4,16.03) 30.4,13.88 C9.2 ; 26.99,17.51 27.15,17.34 Q1.2 ; v1(20.68,19.56) 21.79,19.56 v1(22.91,18.44)
  Bottom Layer w0.508: v1(30.4,16.03) 30.4,16.54 29.62,17.32 v1(27.94,17.32) 24.03,17.32 v1(22.91,18.44) ; v1(13.41,13.41) 15.06,11.76 19.58,11.76 v1(20.68,12.85) v1(20.68,19.56) v1(20.68,24.03)
SLE_DBG_RX: length 39.9
  Top Layer w0.152: U5.23 13.85,24.68 14.85,25.68 15.62,25.68 v1(15.65,25.7) 15.97,25.7 17.65,27.38 R12.2
  Bottom Layer w0.152: v1(15.65,25.7) 15.62,25.68 15.62,18.22 11.59,14.19 11.59,8.93 7.06,4.39 U6.5
SLE_DBG_TX: length 40
  Top Layer w0.152: R11.2 22.22,27.08 17.77,27.08 15.87,25.17 15.11,25.17 v1(15.09,25.15) 14.74,25.15 14.15,24.55 14.15,23.16 14.25,23.06 U5.22
  Bottom Layer w0.152: v1(15.09,25.15) 15.32,24.92 15.32,18.34 11.29,14.32 11.29,9.06 5.06,2.82 U6.1
SLE_USB_N: length 21.2
  Top Layer w0.152: U2.7 29.13,34.72 27.94,33.53 27.94,26.95 21.64,20.65 19.25,20.65 19.15,20.56 U5.9
SLE_USB_P: length 20.5
  Top Layer w0.152: U2.8 28.49,34.51 27.63,33.65 27.63,27.08 21.52,20.96 U5.10
SWD_CLK: length 43.5
  Top Layer w0.152: v1(8.94,27.94) 9.5,27.38 R8.1
  Bottom Layer w0.152: v1(8.94,27.94) 18.01,27.94 21.79,24.16 21.79,17.77 25.44,14.12 25.44,12.17 U6.6
SWD_DAT: length 45.6
  Top Layer w0.152: R6.1 9.5,26.26 v1(8.38,27.38)
  Bottom Layer w0.152: v1(8.38,27.38) 8.38,28.14 8.72,28.47 9.16,28.47 9.39,28.25 18.14,28.25 22.1,24.28 22.1,17.89 25.74,14.25 25.74,12.05 17.06,3.36 U6.7
SWDCLK: length 7.9
  Top Layer w0.152: R9.2 R8.2 10.49,27.33 11,26.82 11,22.88 12.12,21.76 U5.25
SWDIO: length 6.3
  Top Layer w0.152: R6.2 10.7,26.06 10.7,25.33 10.52,25.15 R7.2 10.7,24.94 10.7,22.75 12.09,21.36 U5.26
SYS_3V3: length 38.2
  Top Layer w0.152: U3.5 26.99,12.29 26.55,11.86 R3.2 ; 34.81,13.29 34.81,9.33 37.01,7.14 R1.2
  Top Layer w0.508: v1(32.97,14.53) C1.2 34.53,13.01 34.81,13.29 ; U3.5 27.36,14.53 v1(27.94,14.53)
  Bottom Layer w0.508: v1(32.97,14.53) v1(27.94,14.53) 27.94,10.68 U6.9
SYS_5V0: length 70.7
  Top Layer w0.152: v1(30.23,21.41) 29.84,21.79 D3.5 ; 36.32,29.6 C4.2 ; 36.32,29.6 36.32,25.04 v1(34.75,23.47) ; 36.32,29.6 35.64,29.6 34.53,28.5 31.29,28.5 30.41,29.38 30.41,30.25
  Top Layer w0.381: 33.38,24.19 34.03,24.19 34.75,23.47 v1(34.75,23.47) 35.56,22.66 35.56,20.93 35.53,20.9 ; D1.2 v1(40.23,18.03) 37.36,20.9 35.53,20.9 ; USB1.A4 34.02,19.39 35.53,20.9
  Bottom Layer w0.152: v1(30.23,21.41) 32.28,23.47 v1(34.75,23.47)
  Bottom Layer w0.508: v1(40.23,18.03) 40.23,4.47 39.12,3.35 24.62,3.35 U6.10
USB20_CC1: length 12.1
  Top Layer w0.152: USB1.A5 32.76,20.54 32.64,20.42 29.79,20.42 29.62,20.24 26.03,20.24 23.47,17.68 R10.1
USB20_CC2: length 14.6
  Top Layer w0.152: USB1.B5 30.73,23.54 ; R13.2 22.35,16.99 24.59,19.23 v1(24.59,20.12)
  Bottom Layer w0.152: v1(30.73,23.47) 27.94,23.47 v1(24.59,20.12)
USB20_N: length 10.2
  Top Layer w0.152: 29.13,30.25 29.13,29.29 29.47,28.95 29.47,28.43 arc(29.41,28.29) 29.28,28.24 arc(29.09,28.05) 29.28,27.86 arc(29.47,27.67) 29.28,27.48 ; 29.46,26.14 29.46,25.86 27.25,23.65 27.25,22.9 27.1,22.74 D3.1 ; 29.27,26.71 arc(29.08,26.52) 29.27,26.33 arc(29.41,26.28) 29.46,26.14 ; 29.28,26.71 arc(29.47,26.9) 29.28,27.09 arc(29.09,27.28) 29.28,27.48
USB20_P: length 11
  Top Layer w0.152: 29.77,30.25 29.77,25.74 27.56,23.52 27.56,21.03 27.41,20.88 26.83,20.88 D3.3
$1N5: length 2.4
  Top Layer w0.355: L1.2 6.27,22.23 arc(6.26,22.24) 6.24,22.24 5.92,22.56 arc(5.67,22.93) U4.1
$1N6: length 2.3
  Top Layer w0.355: 7.41,21.09 8.16,20.34 arc(8.17,20.33) C7.2 8.34,20.14 arc(8.74,19.86) 9.22,19.76
$1N16: length 2.3
  Top Layer w0.152: Q1.3 R5.1
$1N45: length 4.8
  Top Layer w0.508: U1.3 38.26,11.29 C2.2 39.73,11.59 D1.1
$1N49: length 4.5
  Top Layer w0.203: L2.2 17.45,14.3 U5.47
$1N98: length 2.2
  Top Layer w0.152: R1.1 39,6.27 D2.2
$1N2110: length 6.7
  Top Layer w0.305: 18.62,17.24 23.03,12.84 C12.2
$1N2624: length 4.6
  Top Layer w0.203: U5.33 11.98,18.56 9.93,16.51 9.93,16.09 C14.2
$1N2741: length 3.8
  Top Layer w0.203: C13.2 10.19,17.32 11.82,18.96 U5.32
$1N3792: length 7.6
  Top Layer w0.203: U5.46 17.05,13.83 C6.2 18.48,10.72 L2.1
$1N4086: length 5.3
  Top Layer w0.152: U7.9 25.65,30.17 24.94,29.47 24.94,27.99 24.41,27.46 24.41,27.02 23.9,26.5 R11.1
$1N4091: length 4
  Top Layer w0.152: U7.8 25.15,30.1 24.64,29.59 24.64,28.12 R12.1
$1N5044: length 5.3
  Top Layer w0.152: R4.2 25.15,13.41 24.44,14.12 24.44,15.46 25.09,16.11 25.09,17.51
$1N8181: length 26.1
  Top Layer w0.152: 28.55,12.84 28.57,12.84 29.12,13.39 29.12,16.22 30.24,17.34 Q1.1 ; 28.55,12.84 C11.2 ; 28.55,12.84 29.06,12.33 29.06,10.52 34.05,5.53 SW1.1 ; R3.1 25.09,13.9 U3.4 25.09,15.33 v1(25.62,15.86)
  Bottom Layer w0.152: v1(25.62,15.86) 28.71,15.86 v1(29.06,16.2)

## Copper pours and planes (outline as drawn; the poured copper is in the pictures)
GND on Top Layer: -1.12,40.79 42.47,40.79 42.47,-0.56 -1.12,-0.56
GND on Bottom Layer: -0.48,40.58 43.1,40.58 43.1,-0.77 -0.48,-0.77
$1N49 on Top Layer: 17.32,16.2 17.88,16.2 20.12,13.97 20.12,11.73 17.88,11.73 17.32,12.29
$1N3792 on Top Layer: 17.32,16.2 16.76,16.2 16.76,14.53 15.65,13.41 15.65,12.29 16.21,12.29 18.44,10.06 20.12,10.06 20.12,11.72 18.45,11.72 17.32,12.85

## Text on the board
Top Silkscreen Layer: JLCJLCJLCJLC
